# Altium schematic sheet Debugger.SchDoc
size A4; SheetNumber: 21; SheetTotal: 21
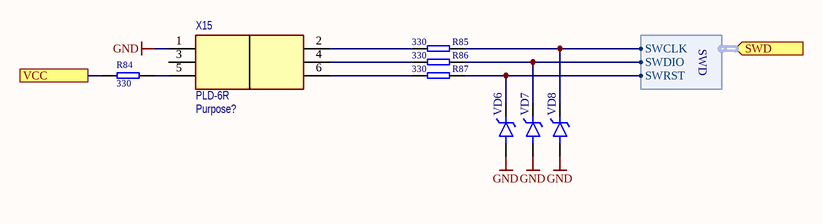
[diagram p0: Debugger.SchDoc]

## Parts
R84  value 330  [RES 0402]  (no BOM)
R85  value 330  [RES 0402]
R86  value 330  [RES 0402]
R87  value 330  [RES 0402]
VD6  DiodeTVSs  [SOD-323]  (value not drawn)
VD7  DiodeTVSs  [SOD-323]  (value not drawn)
VD8  DiodeTVSs  [SOD-323]  (value not drawn)
X15  PLD-6R  Purpose: Purpose?  [PBD-6-2.54]

## Ports
SWD (in, harness SWD), VCC

## Harnesses
SWD: SWDIO, SWCLK, SWRST

## Nets
GND: VD6.A(Anode) VD7.A(Anode) VD8.A(Anode) X15.1
VCC: R84.2 ; port VCC
NetR84_1: R84.1 X15.5
NetR85_1: R85.1 X15.2
NetR85_2: R85.2 VD8.C(Cathode) ; port SWD.SWCLK
NetR86_1: R86.1 X15.4
NetR86_2: R86.2 VD7.C(Cathode) ; port SWD.SWDIO
NetR87_1: R87.1 X15.6
NetR87_2: R87.2 VD6.C(Cathode) ; port SWD.SWRST

Not connected (* = marked no-connect by the designer): X15 3

## Library data of the parts
R84-R87 = !Resistor: Resistor; IsSMT: NoSMT
VD6-VD8 = DiodeTVSs: Diode TVS Single; IsSMT: NoSMT; Order: *; BuyLink1: *; LCSC Part #: *
X15 = Header 2x3: 3x2 header; IsSMT: NoSMT